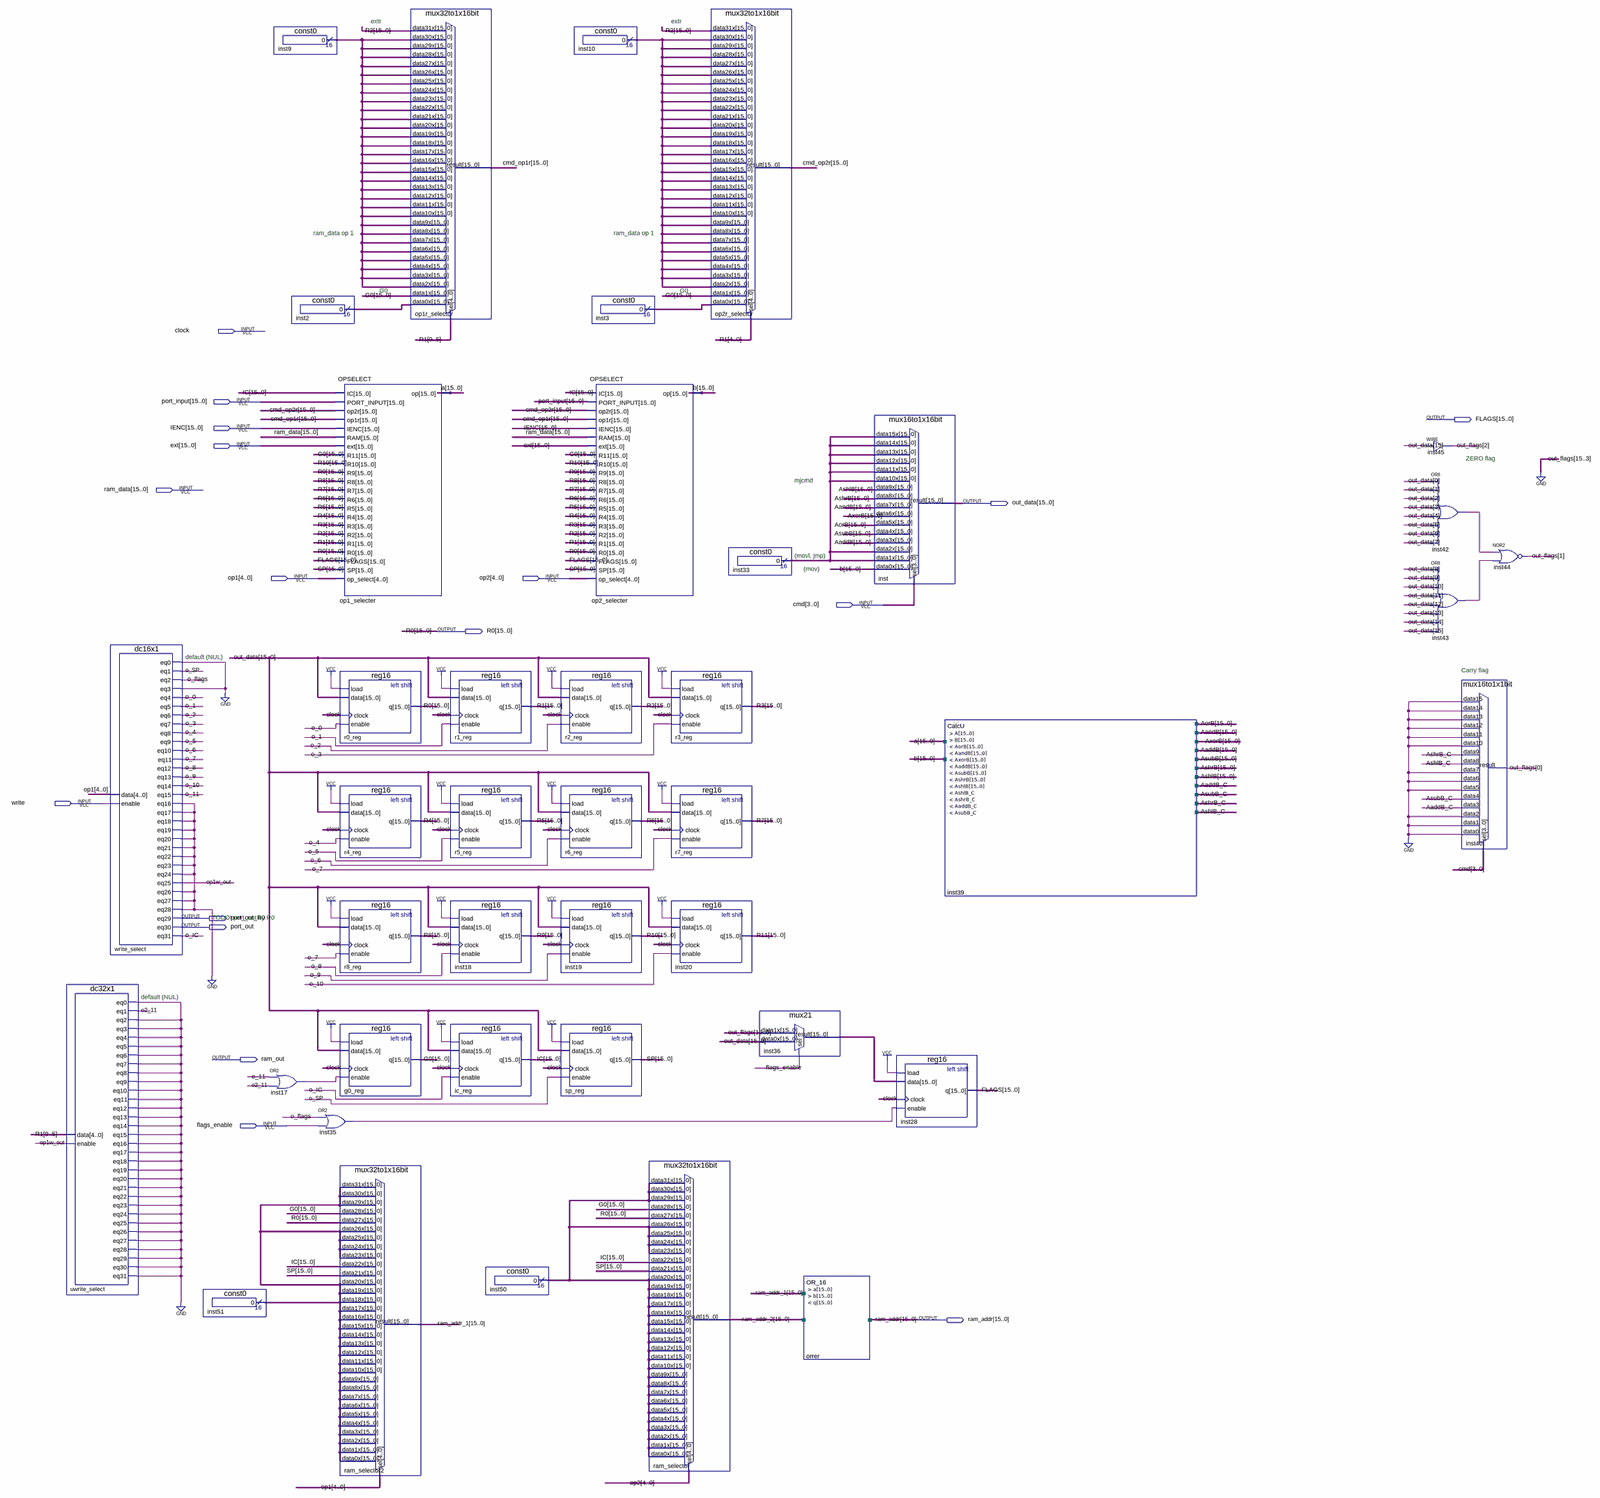
[diagram p0: schematic sheet, whole]
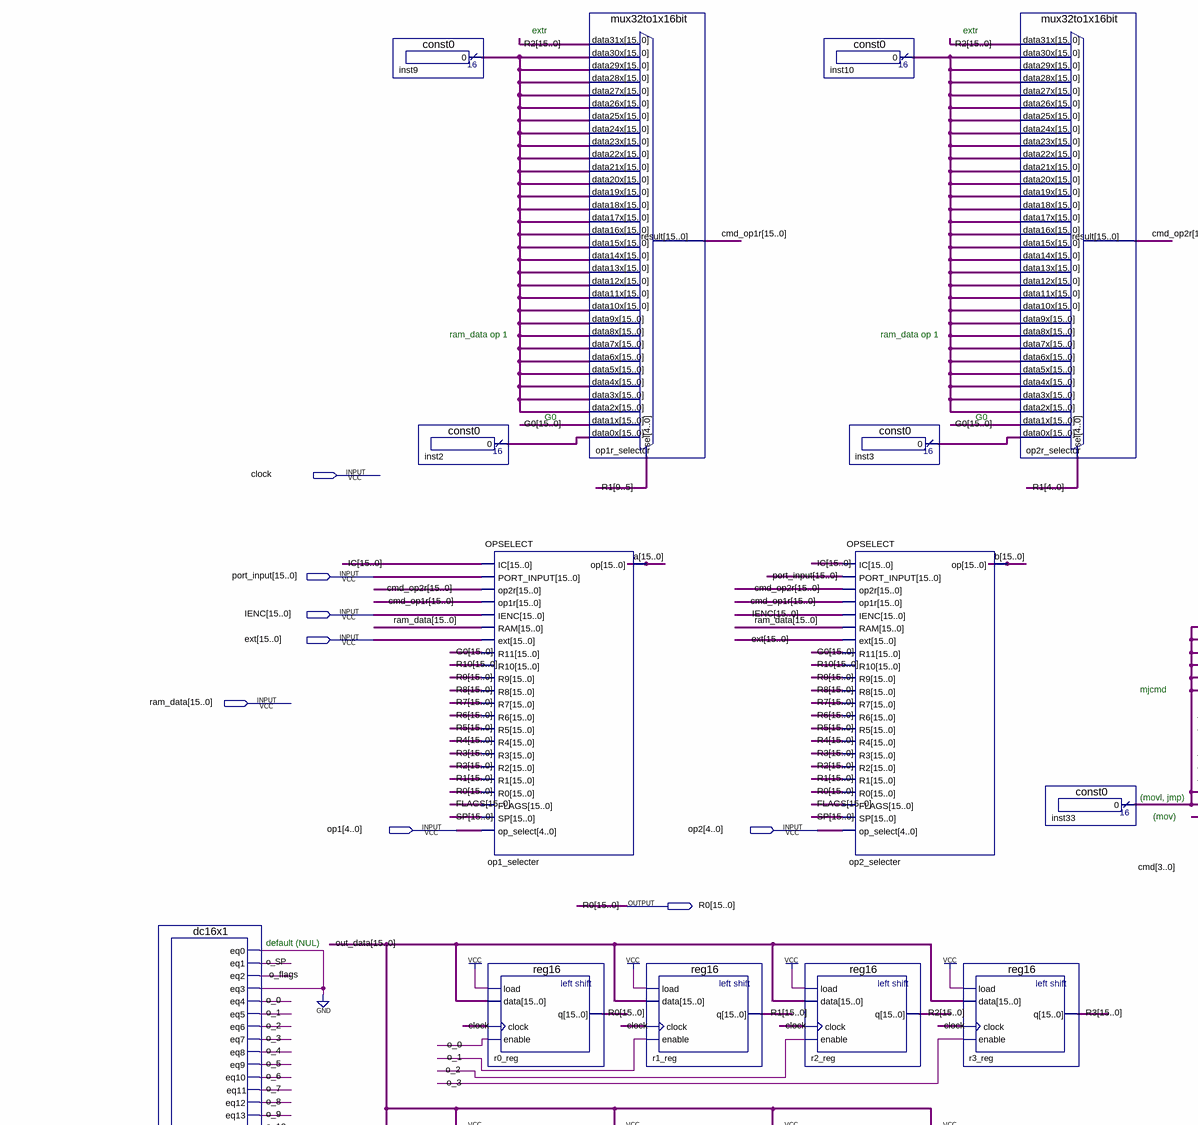
[diagram p1: schematic sheet, upper left part]
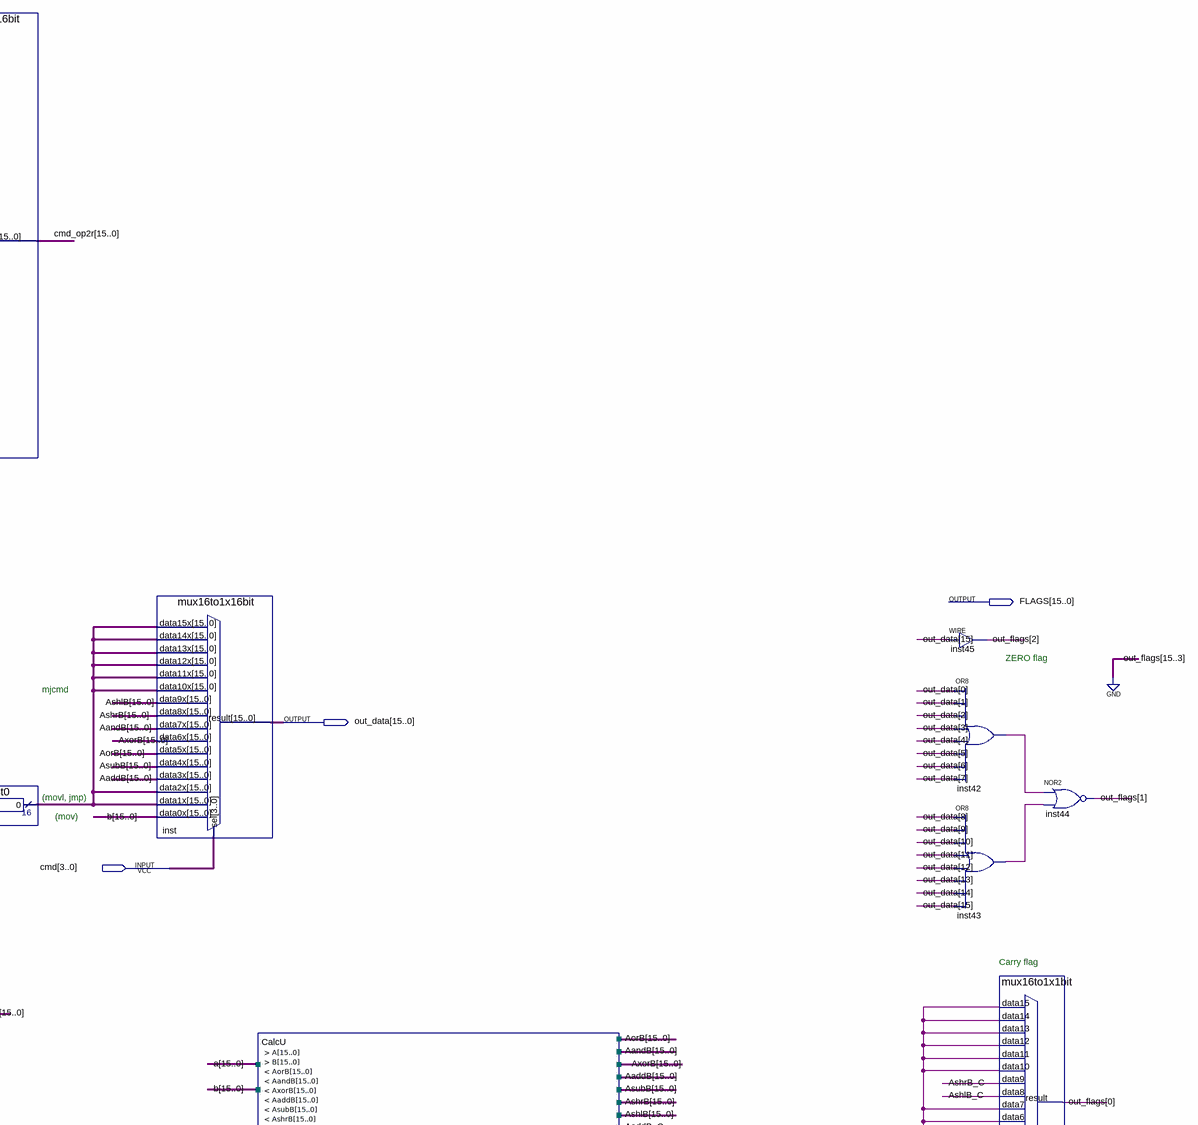
[diagram p2: schematic sheet, upper right part]
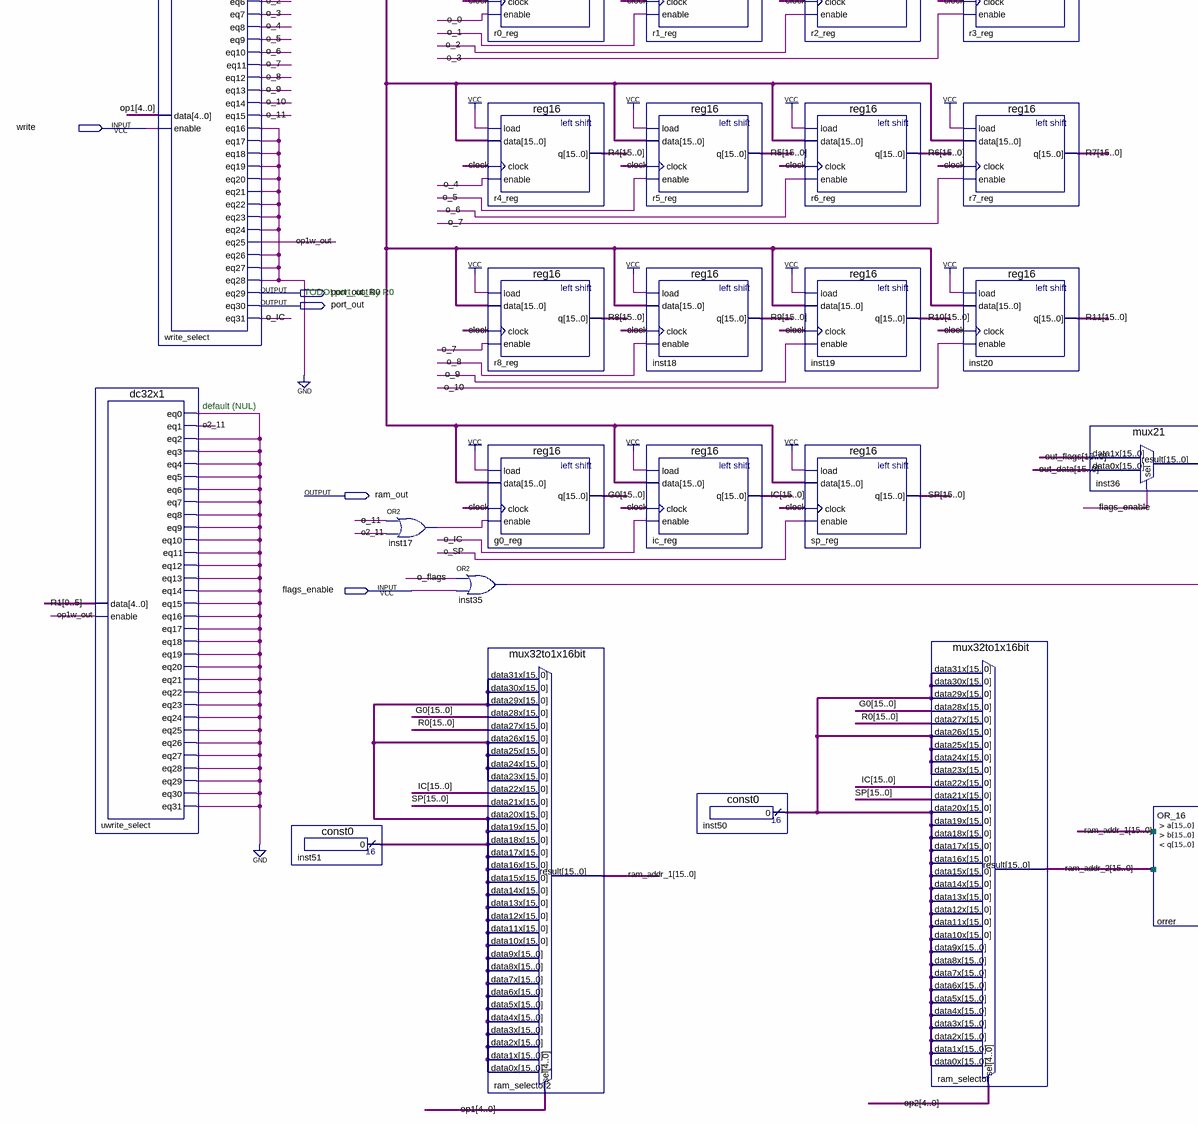
[diagram p3: schematic sheet, lower left part]
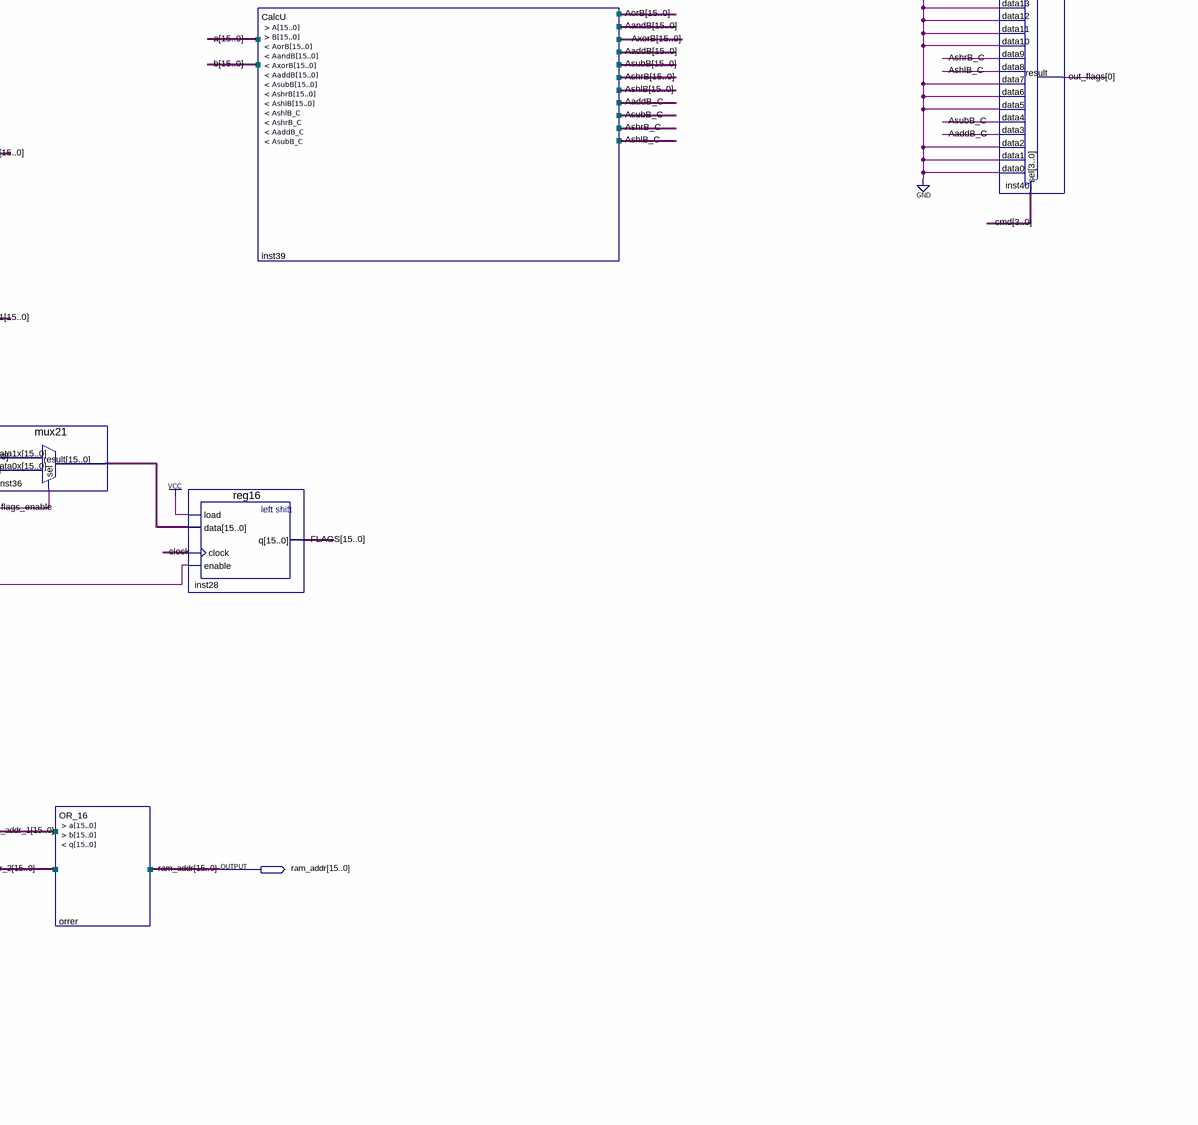
[diagram p4: schematic sheet, lower right part]
// Quartus schematic ALU.bdf as structural Verilog: 42 symbols, 17 pins
module ALU (
  input  clock,
  input  [15:0] port_input,
  input  [15:0] IENC,
  input  [15:0] ext,
  input  [15:0] ram_data,
  input  [4:0] op1,
  input  [4:0] op2,
  input  [3:0] cmd,
  input  write,
  input  flags_enable,
  output [15:0] FLAGS,
  output [15:0] out_data,
  output [15:0] R0,
  output port_out_R0,
  output port_out,
  output ram_out,
  output [15:0] ram_addr
);

  wire AaddB_C, AshlB_C, AshrB_C, AsubB_C, inst17_out, inst35_out, inst42_out, inst43_out, o2_11, o_0, o_1,
       o_2, o_3, o_4, o_5, o_6, o_7, o_8, o_9, o_10, o_11, o_flags, o_IC, o_SP, op1w_out, uwrite_select_eq0,
       write_select_eq0, write_select_eq16;
  wire [2:0] out_flags;
  wire [15:0] a, AaddB, AandB, AorB, AshlB, AshrB, AsubB, AxorB, b, cmd_op1r, cmd_op2r, G0, IC, inst2_result,
       inst3_result, inst9_result, inst10_result, inst33_result, inst36_result, inst50_result, inst51_result,
       R1, R2, R3, R4, R5, R6, R7, R8, R9, R10, R11, ram_addr_1, ram_addr_2, SP;

  dc32x1 uwrite_select (
    .data(R1[9:5]), .enable(op1w_out), .eq0(uwrite_select_eq0), .eq1(o2_11), .eq2(uwrite_select_eq0),
    .eq3(uwrite_select_eq0), .eq4(uwrite_select_eq0), .eq5(uwrite_select_eq0), .eq6(uwrite_select_eq0),
    .eq7(uwrite_select_eq0), .eq8(uwrite_select_eq0), .eq9(uwrite_select_eq0), .eq10(uwrite_select_eq0),
    .eq11(uwrite_select_eq0), .eq12(uwrite_select_eq0), .eq13(uwrite_select_eq0), .eq14(uwrite_select_eq0),
    .eq15(uwrite_select_eq0), .eq16(uwrite_select_eq0), .eq17(uwrite_select_eq0), .eq18(uwrite_select_eq0),
    .eq19(uwrite_select_eq0), .eq20(uwrite_select_eq0), .eq21(uwrite_select_eq0), .eq22(uwrite_select_eq0),
    .eq23(uwrite_select_eq0), .eq24(uwrite_select_eq0), .eq25(uwrite_select_eq0), .eq26(uwrite_select_eq0),
    .eq27(uwrite_select_eq0), .eq28(uwrite_select_eq0), .eq29(uwrite_select_eq0), .eq30(uwrite_select_eq0),
    .eq31(uwrite_select_eq0));
  dc16x1 write_select (
    .data(op1), .enable(write), .eq0(write_select_eq0), .eq1(o_SP), .eq2(o_flags), .eq3(write_select_eq0),
    .eq4(o_0), .eq5(o_1), .eq6(o_2), .eq7(o_3), .eq8(o_4), .eq9(o_5), .eq10(o_6), .eq11(o_7), .eq12(o_8),
    .eq13(o_9), .eq14(o_10), .eq15(o_11), .eq16(write_select_eq16), .eq17(write_select_eq16),
    .eq18(write_select_eq16), .eq19(write_select_eq16), .eq20(write_select_eq16), .eq21(write_select_eq16),
    .eq22(write_select_eq16), .eq23(write_select_eq16), .eq24(write_select_eq16), .eq25(op1w_out),
    .eq26(write_select_eq16), .eq27(write_select_eq16), .eq28(write_select_eq16), .eq29(port_out_R0),
    .eq30(port_out), .eq31(o_IC));
  const0 inst51 (.result(inst51_result));
  const0 inst9 (.result(inst9_result));
  or inst17 (inst17_out, o_11, o2_11);
  const0 inst2 (.result(inst2_result));
  OPSELECT op1_selecter (
    .IC(IC), .PORT_INPUT(port_input), .op2r(cmd_op2r), .op1r(cmd_op1r), .IENC(IENC), .RAM(ram_data),
    .ext(ext), .R11(G0), .R10(R10), .R9(R9), .R8(R8), .R7(R7), .R6(R6), .R5(R5), .R4(R4), .R3(R3), .R2(R2),
    .R1(R1), .R0(R0), .FLAGS(FLAGS), .SP(SP), .op_select(op1), .op(a));
  reg16 r0_reg (.load(1'b1), .data(out_data), .clock(clock), .enable(o_0), .q(R0));
  reg16 r4_reg (.load(1'b1), .data(out_data), .clock(clock), .enable(o_4), .q(R4));
  reg16 r8_reg (.load(1'b1), .data(out_data), .clock(clock), .enable(o_7), .q(R8));
  reg16 g0_reg (.load(1'b1), .data(out_data), .clock(clock), .enable(inst17_out), .q(G0));
  or inst35 (inst35_out, o_flags, flags_enable);
  mux32to1x16bit ram_selector2 (
    .data31x(inst51_result), .data30x(inst51_result), .data29x(inst51_result), .data28x(G0), .data27x(R0),
    .data26x(inst51_result), .data25x(inst51_result), .data24x(inst51_result), .data23x(inst51_result),
    .data22x(IC), .data21x(SP), .data20x(inst51_result), .data19x(inst51_result), .data18x(inst51_result),
    .data17x(inst51_result), .data16x(inst51_result), .data15x(inst51_result), .data14x(inst51_result),
    .data13x(inst51_result), .data12x(inst51_result), .data11x(inst51_result), .data10x(inst51_result),
    .data9x(inst51_result), .data8x(inst51_result), .data7x(inst51_result), .data6x(inst51_result),
    .data5x(inst51_result), .data4x(inst51_result), .data3x(inst51_result), .data2x(inst51_result),
    .data1x(inst51_result), .data0x(inst51_result), .sel(op1), .result(ram_addr_1));
  mux32to1x16bit op1r_selector (
    .data31x(R2), .data30x(inst9_result), .data29x(inst9_result), .data28x(inst9_result),
    .data27x(inst9_result), .data26x(inst9_result), .data25x(inst9_result), .data24x(inst9_result),
    .data23x(inst9_result), .data22x(inst9_result), .data21x(inst9_result), .data20x(inst9_result),
    .data19x(inst9_result), .data18x(inst9_result), .data17x(inst9_result), .data16x(inst9_result),
    .data15x(inst9_result), .data14x(inst9_result), .data13x(inst9_result), .data12x(inst9_result),
    .data11x(inst9_result), .data10x(inst9_result), .data9x(inst9_result), .data8x(inst9_result),
    .data7x(inst9_result), .data6x(inst9_result), .data5x(inst9_result), .data4x(inst9_result),
    .data3x(inst9_result), .data2x(inst9_result), .data1x(G0), .data0x(inst2_result), .sel(R1[9:5]),
    .result(cmd_op1r));
  reg16 r1_reg (.load(1'b1), .data(out_data), .clock(clock), .enable(o_1), .q(R1));
  reg16 r5_reg (.load(1'b1), .data(out_data), .clock(clock), .enable(o_5), .q(R5));
  reg16 inst18 (.load(1'b1), .data(out_data), .clock(clock), .enable(o_8), .q(R9));
  reg16 ic_reg (.load(1'b1), .data(out_data), .clock(clock), .enable(o_IC), .q(IC));
  const0 inst50 (.result(inst50_result));
  const0 inst10 (.result(inst10_result));
  const0 inst3 (.result(inst3_result));
  OPSELECT op2_selecter (
    .IC(IC), .PORT_INPUT(port_input), .op2r(cmd_op2r), .op1r(cmd_op1r), .IENC(IENC), .RAM(ram_data),
    .ext(ext), .R11(G0), .R10(R10), .R9(R9), .R8(R8), .R7(R7), .R6(R6), .R5(R5), .R4(R4), .R3(R3), .R2(R2),
    .R1(R1), .R0(R0), .FLAGS(FLAGS), .SP(SP), .op_select(op2), .op(b));
  reg16 r2_reg (.load(1'b1), .data(out_data), .clock(clock), .enable(o_2), .q(R2));
  reg16 r6_reg (.load(1'b1), .data(out_data), .clock(clock), .enable(o_6), .q(R6));
  reg16 inst19 (.load(1'b1), .data(out_data), .clock(clock), .enable(o_9), .q(R10));
  reg16 sp_reg (.load(1'b1), .data(out_data), .clock(clock), .enable(o_SP), .q(SP));
  mux32to1x16bit ram_selector (
    .data31x(inst50_result), .data30x(inst50_result), .data29x(inst50_result), .data28x(G0), .data27x(R0),
    .data26x(inst50_result), .data25x(inst50_result), .data24x(inst50_result), .data23x(inst50_result),
    .data22x(IC), .data21x(SP), .data20x(inst50_result), .data19x(inst50_result), .data18x(inst50_result),
    .data17x(inst50_result), .data16x(inst50_result), .data15x(inst50_result), .data14x(inst50_result),
    .data13x(inst50_result), .data12x(inst50_result), .data11x(inst50_result), .data10x(inst50_result),
    .data9x(inst50_result), .data8x(inst50_result), .data7x(inst50_result), .data6x(inst50_result),
    .data5x(inst50_result), .data4x(inst50_result), .data3x(inst50_result), .data2x(inst50_result),
    .data1x(inst50_result), .data0x(inst50_result), .sel(op2), .result(ram_addr_2));
  reg16 r3_reg (.load(1'b1), .data(out_data), .clock(clock), .enable(o_3), .q(R3));
  reg16 r7_reg (.load(1'b1), .data(out_data), .clock(clock), .enable(o_7), .q(R7));
  reg16 inst20 (.load(1'b1), .data(out_data), .clock(clock), .enable(o_10), .q(R11));
  mux32to1x16bit op2r_selector (
    .data31x(R2), .data30x(inst10_result), .data29x(inst10_result), .data28x(inst10_result),
    .data27x(inst10_result), .data26x(inst10_result), .data25x(inst10_result), .data24x(inst10_result),
    .data23x(inst10_result), .data22x(inst10_result), .data21x(inst10_result), .data20x(inst10_result),
    .data19x(inst10_result), .data18x(inst10_result), .data17x(inst10_result), .data16x(inst10_result),
    .data15x(inst10_result), .data14x(inst10_result), .data13x(inst10_result), .data12x(inst10_result),
    .data11x(inst10_result), .data10x(inst10_result), .data9x(inst10_result), .data8x(inst10_result),
    .data7x(inst10_result), .data6x(inst10_result), .data5x(inst10_result), .data4x(inst10_result),
    .data3x(inst10_result), .data2x(inst10_result), .data1x(G0), .data0x(inst3_result), .sel(R1[4:0]),
    .result(cmd_op2r));
  const0 inst33 (.result(inst33_result));
  mux21 inst36 (.data1x({{13{1'b0}}, out_flags}), .data0x(out_data), .sel(flags_enable), .result(inst36_result));
  OR_16 orrer (.a(ram_addr_1), .b(ram_addr_2), .q(ram_addr));
  mux16to1x16bit inst (
    .data15x(inst33_result), .data14x(inst33_result), .data13x(inst33_result), .data12x(inst33_result),
    .data11x(inst33_result), .data10x(inst33_result), .data9x(AshlB), .data8x(AshrB), .data7x(AandB),
    .data6x(AxorB), .data5x(AorB), .data4x(AsubB), .data3x(AaddB), .data2x(inst33_result),
    .data1x(inst33_result), .data0x(b), .sel(cmd), .result(out_data));
  reg16 inst28 (.load(1'b1), .data(inst36_result), .clock(clock), .enable(inst35_out), .q(FLAGS));
  CalcU inst39 (
    .A(a), .B(b), .AorB(AorB), .AandB(AandB), .AxorB(AxorB), .AaddB(AaddB), .AsubB(AsubB), .AshrB(AshrB),
    .AshlB(AshlB), .AshlB_C(AshlB_C), .AshrB_C(AshrB_C), .AaddB_C(AaddB_C), .AsubB_C(AsubB_C));
  assign out_flags[2] = out_data[15];  // WIRE inst45
  or inst42 (inst42_out, out_data[0], out_data[1], out_data[2], out_data[3], out_data[4], out_data[5], out_data[6], out_data[7]);
  or inst43 (inst43_out, out_data[8], out_data[9], out_data[10], out_data[11], out_data[12], out_data[13], out_data[14], out_data[15]);
  mux16to1x1bit inst40 (
    .data15(1'b0), .data14(1'b0), .data13(1'b0), .data12(1'b0), .data11(1'b0), .data10(1'b0),
    .data9(AshrB_C), .data8(AshlB_C), .data7(1'b0), .data6(1'b0), .data5(1'b0), .data4(AsubB_C),
    .data3(AaddB_C), .data2(1'b0), .data1(1'b0), .data0(1'b0), .sel(cmd), .result(out_flags[0]));
  nor inst44 (out_flags[1], inst42_out, inst43_out);
  // also tied to GND on the sheet: {write_select_eq0, write_select_eq16, uwrite_select_eq0}

  // Notes on the sheet:
  //   extr
  //   extr
  //   ram_data op 1
  //   ram_data op 1
  //   G0
  //   G0
  //   ZERO flag
  //   mjcmd
  //   (movl, jmp)
  //   (mov)
  //   default (NUL)
  //   Carry flag
  //   TODO! port_out by R0
  //   default (NUL)
endmodule
